# Altium schematic sheet STM32F100RB.SchDoc
size A4
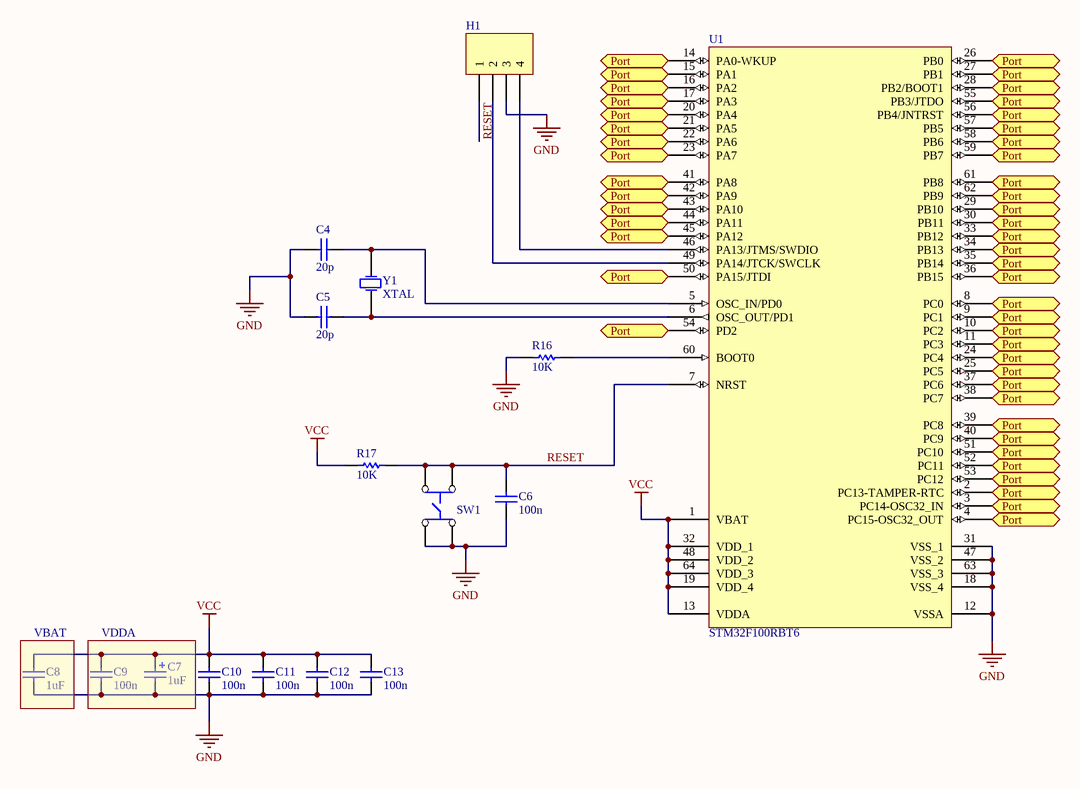
[diagram p0: STM32F100RB.SchDoc]

## Parts
C4  value 20p  [0805]  (hidden comment: Cap)
C5  value 20p  [0805]  (hidden comment: Cap)
C6  value 100n  [0805]  (hidden comment: Cap)
C7  value 1uF  [RB.1/.2]  (hidden comment: Cap Pol1)
C8  value 1uF  [0805]  (hidden comment: Cap)
C9  value 100n  [0805]  (hidden comment: Cap)
C10  value 100n  [0805]  (hidden comment: Cap)
C11  value 100n  [0805]  (hidden comment: Cap)
C12  value 100n  [0805]  (hidden comment: Cap)
C13  value 100n  [0805]  (hidden comment: Cap)
H1  Header 4  [HDR1X4]  (value not drawn)
R16  value 10K  [0805]  (hidden comment: Res)
R17  value 10K  [0805]  (hidden comment: Res)
SW1  SW_PB  [SW_PB]  (value not drawn)
U1  STM32F100RBT6  [LQFP64_N]
Y1  XTAL  [XTAL]

## Blocks framed on the sheet
VBAT: C8
VDDA: C7 C9

## Ports
Port

## Nets
GND: C4.1 C5.1 C6.1 C7.2 C8.1 C9.1 C10.1 C11.1 C12.1 C13.1 H1.3 R16.2 SW1.1 SW1.3 U1.12(VSSA) U1.18(VSS_4) U1.31(VSS_1) U1.47(VSS_2) U1.63(VSS_3)
VCC: C7.1 C8.2 C9.2 C10.2 C11.2 C12.2 C13.2 R17.1 U1.1(VBAT) U1.13(VDDA) U1.19(VDD_4) U1.32(VDD_1) U1.48(VDD_2) U1.64(VDD_3)
Port: U1.2(PC13-TAMPER-RTC) U1.3(PC14-OSC32_IN) U1.4(PC15-OSC32_OUT) U1.8(PC0) U1.9(PC1) U1.10(PC2) U1.11(PC3) U1.14(PA0-WKUP) U1.15(PA1) U1.16(PA2) U1.17(PA3) U1.20(PA4) U1.21(PA5) U1.22(PA6) U1.23(PA7) U1.24(PC4) U1.25(PC5) U1.26(PB0) U1.27(PB1) U1.28(PB2/BOOT1) U1.29(PB10) U1.30(PB11) U1.33(PB12) U1.34(PB13) U1.35(PB14) U1.36(PB15) U1.37(PC6) U1.38(PC7) U1.39(PC8) U1.40(PC9) U1.41(PA8) U1.42(PA9) U1.43(PA10) U1.44(PA11) U1.45(PA12) U1.50(PA15/JTDI) U1.51(PC10) U1.52(PC11) U1.53(PC12) U1.54(PD2) U1.55(PB3/JTDO) U1.56(PB4/JNTRST) U1.57(PB5) U1.58(PB6) U1.59(PB7) U1.61(PB8) U1.62(PB9) ; port Port
RESET: C6.2 H1.1 R17.2 SW1.2 SW1.4 U1.7(NRST)
NetC4_2: C4.2 U1.5(OSC_IN/PD0) Y1.2(OSC2)
NetC5_2: C5.2 U1.6(OSC_OUT/PD1) Y1.1(OSC1)
NetH1_2: H1.2 U1.49(PA14/JTCK/SWCLK)
NetH1_4: H1.4 U1.46(PA13/JTMS/SWDIO)
NetR16_1: R16.1 U1.60(BOOT0)

## Library data of the parts
C4-C6 C8-C13 = Cap: Capacitor; Manufacturer: Generic Components; Class: Passive; Published: 08/06/2000; Publisher: Altium Hobart Technology Centre; SubClass: Capacitor
C7 = Cap Pol1: Polarized Capacitor (Radial); Manufacturer: Generic Components; Class: Passive; Published: 08/06/2000; Publisher: Altium Hobart Technology Centre; SubClass: Capacitor
H1 = Header 4: Header, 4-Pin; Manufacturer: Generic Components; Class: Connector
R16 R17 = Res: Resistor; Manufacturer: Generic Components; Class: Passive; Published: 08/06/2000; Publisher: Altium Hobart Technology Centre; SubClass: Resistor
U1 = STM32F100RBT6: STM32 ARM-based 32-bit MCU with 128 Kbytes Flash, 64-pin LQFP, Industrial Temperature; Published: 30-May-2008; PackageVersion: Mar-2008; PackageReference: LQFP64; Publisher: Altium Limited; PackageDescription: 64-Pin Low-Profile Quad Flat Pack, 10 x 10 mm Body, 0.5 mm Pitch (LQFP64); ComponentLink1Description: Manufacturer Link; ComponentLink1URL: www.st.com/stm32; ComponentLink2Description: Datasheet